# Altium schematic sheet FG Command Controller Electronic Scheme_2021-10-20.schdoc
size 297 x 203 mm
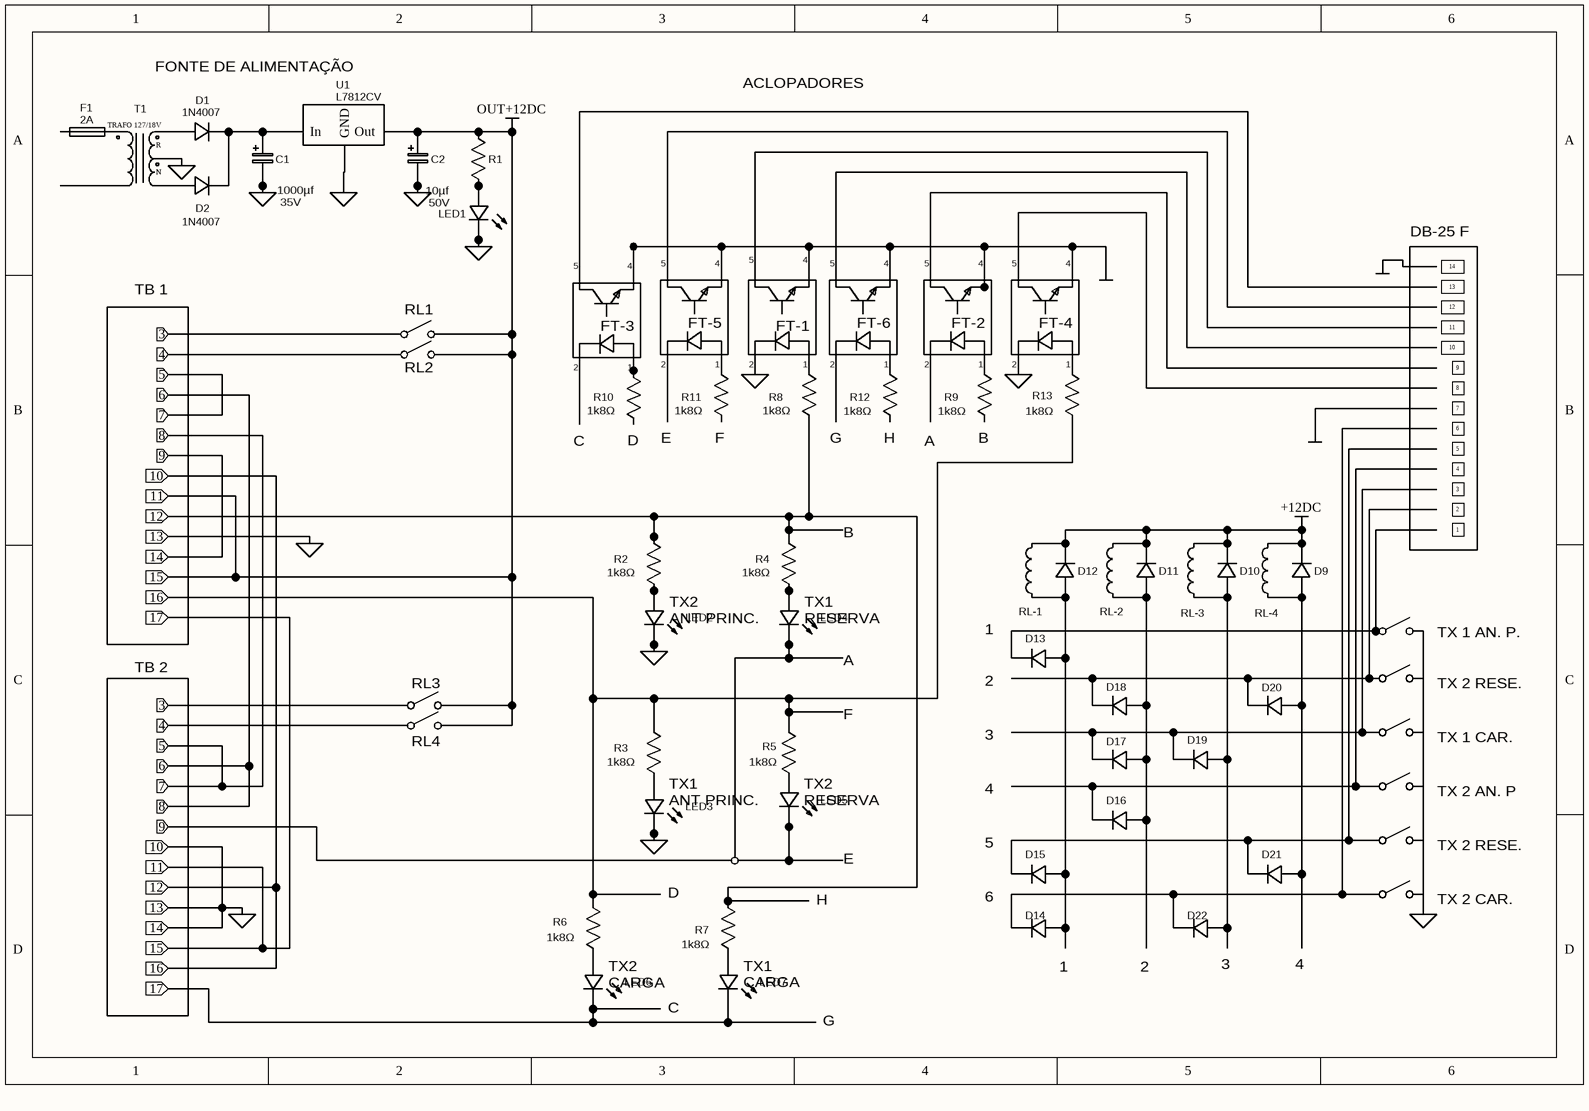
[diagram p0: FG Command Controller Electronic Scheme_2021-10-20.schdoc]

## Parts
6  MMBT5551  [SOT-23(SOT-23-3)]  (value not drawn)
C1  1u  [CAP-D3.0XF1.5]  (value not drawn)
C2  1u  [CAP-D3.0XF1.5]  (value not drawn)
D1  1N4007  [DO35-10]
D2  1N4007  [DO35-10]
D3  1N4148  [DO35-10]  (value not drawn)
D4  1N4148  [DO35-10]  (value not drawn)
D5  1N4148  [DO35-10]  (value not drawn)
D6  1N4148  [DO35-10]  (value not drawn)
D7  1N4148  [DO35-10]  (value not drawn)
D8  1N4148  [DO35-10]  (value not drawn)
D9  1N4148  [DO35-10]  (value not drawn)
D10  1N4148  [DO35-10]  (value not drawn)
D11  1N4148  [DO35-10]  (value not drawn)
D12  1N4148  [DO35-10]  (value not drawn)
D13  1N4148  [DO35-10]  (value not drawn)
D14  1N4148  [DO35-10]  (value not drawn)
D15  1N4148  [DO35-10]  (value not drawn)
D16  1N4148  [DO35-10]  (value not drawn)
D17  1N4148  [DO35-10]  (value not drawn)
D18  1N4148  [DO35-10]  (value not drawn)
D19  1N4148  [DO35-10]  (value not drawn)
D20  1N4148  [DO35-10]  (value not drawn)
D21  1N4148  [DO35-10]  (value not drawn)
D22  1N4148  [DO35-10]  (value not drawn)
F1  2A  [2A-3F-250VAC]
LED1  LED 3MM  [LED-3MM/2.54]  (value not drawn)
LED2  NO  [LED-3MM/2.54]  (value not drawn)
LED3  LED 3MM  [LED-3MM/2.54]  (value not drawn)
LED4  LED 3MM  [LED-3MM/2.54]  (value not drawn)
LED5  LED 3MM  [LED-3MM/2.54]  (value not drawn)
LED6  LED 3MM  [LED-3MM/2.54]  (value not drawn)
LED7  LED 3MM  [LED-3MM/2.54]  (value not drawn)
Q1  MMBT5551  [SOT-23(SOT-23-3)]  (value not drawn)
Q3  MMBT5551  [SOT-23(SOT-23-3)]  (value not drawn)
Q4  MMBT5551  [SOT-23(SOT-23-3)]  (value not drawn)
Q5  MMBT5551  [SOT-23(SOT-23-3)]  (value not drawn)
Q6  MMBT5551  [SOT-23(SOT-23-3)]  (value not drawn)
R1  1k  [AXIAL-0.3]  (value not drawn)
R2  1k  [AXIAL-0.3]  (value not drawn)
R3  1k  [AXIAL-0.3]  (value not drawn)
R4  1k  [AXIAL-0.3]  (value not drawn)
R5  1k  [AXIAL-0.3]  (value not drawn)
R6  1k  [AXIAL-0.3]  (value not drawn)
R7  1k  [AXIAL-0.3]  (value not drawn)
R8  1k  [AXIAL-0.3]  (value not drawn)
R9  1k  [AXIAL-0.3]  (value not drawn)
R10  1k  [AXIAL-0.3]  (value not drawn)
R11  1k  [AXIAL-0.3]  (value not drawn)
R12  1k  [AXIAL-0.3]  (value not drawn)
R13  1k  [AXIAL-0.3]  (value not drawn)
RL-1  1m  [AXIAL-0.4]  (value not drawn)
RL-2  1m  [AXIAL-0.4]  (value not drawn)
RL-3  1m  [AXIAL-0.4]  (value not drawn)
RL-4  1m  [AXIAL-0.4]  (value not drawn)
T1  XFMR_TAP  [TRANSFORMER 2 TO 3]  (value not drawn)
U1  L7812CV  [SOT-223]

## Blocks framed on the sheet
FT-3: D6 Q3
FT-5: D4 Q5
FT-1: D8 Q1
FT-6: D3 Q6
FT-2: 6 D7
FT-4: D5 Q4

## Ports
1 (in), 2 (in), 3 (in), 4 (in), 5 (in), 6 (in), 7 (in), 8 (in), 9 (in), 10 (in), 11 (in), 12 (in), 13 (in), 14 (in), 15 (in), 16 (in), 17 (in)

## Nets
+12DC: D9.2(-) D10.2(-) D11.2(-) D12.2(-) RL-1.2 RL-2.2 RL-3.2 RL-4.2
GND: 6.3(E) C1.2 C2.2 D5.2(-) D8.2(-) LED1.2(-) LED2.2(-) LED3.2(-) LED4.2(-) LED5.2(-) Q1.3(E) Q3.3(E) Q4.3(E) Q5.3(E) Q6.3(E) R2.2 R3.2 R4.2 R5.2 R6.2 R7.2 R8.1 R13.1 T1.4 U1.1(GND) ; port 9, port 10, port 12, port 13, port 14, port 16
OUT+12DC: C2.1 LED6.2(-) LED7.2(-) R1.2 U1.2(Out) ; port 11, port 15, port 17
5: port 5, port 6, port 7, port 8
NetC1_1: C1.1 D1.2(-) D2.2(-) U1.3(In)
NetD1_1: D1.1(+) T1.5
NetD2_1: D2.1(+) T1.3
NetD3_1: D3.1(+) R12.2
NetD4_1: D4.1(+) R11.2
NetD5_1: D5.1(+) R13.2
NetD6_1: D6.1(+) R10.2
NetD7_1: D7.1(+) R9.2
NetD8_1: D8.1(+) R8.2
NetD9_1: D9.1(+) D12.1(+) D13.1(+) D13.2(-) D14.1(+) D15.1(+) D20.1(+) D21.1(+) RL-1.1 RL-4.1
NetD10_1: D10.1(+) D19.1(+) D22.1(+) RL-3.1
NetD11_1: D11.1(+) D16.1(+) D17.1(+) D18.1(+) RL-2.1
NetD14_2: D14.2(-) D22.2(-)
NetD15_2: D15.2(-) D21.2(-)
NetD17_2: D17.2(-) D18.2(-) D19.2(-) D20.2(-)
NetF1_2: F1.2 T1.1
NetLED1_1: LED1.1(+) R1.1
NetLED2_1: LED2.1(+) R2.1
NetLED3_1: LED3.1(+) R3.1
NetLED4_1: LED4.1(+) R4.1
NetLED5_1: LED5.1(+) R5.1
NetLED6_1: LED6.1(+) R6.1
NetLED7_1: LED7.1(+) R7.1

Not connected (* = marked no-connect by the designer): 6 1(B) 2(C); D3 2(-); D4 2(-); D6 2(-); D7 2(-); D16 2(-); F1 1; Q1 1(B) 2(C); Q3 1(B) 2(C); Q4 1(B) 2(C); Q5 1(B) 2(C); Q6 1(B) 2(C); R9 1; R10 1; R11 1; R12 1; T1 2

## Notes on the sheet
- FONTE DE ALIMENTAÇÃO
- ACLOPADORES
- 1000µf
  35V
- 10µf
  50V
- TB 1
- (near Q3) 5
- (near Q3) 4
- (near Q5) 5
- (near Q5) 4
- (near Q1) 5
- (near Q1) 4
- 5
- (near Q6) 4
- (near 6) 5
- (near 6) 4
- (near Q4) 5
- (near Q4) 4
- DB-25 F
- RL1
- (near D6) 2
- (near R10) 1
- 2
- (near R11) 1
- (near R8) 1
- (near R12) 1
- (near R9) 1
- (near R13) 1
- RL2
- (near R10) 1k8Ω
- 1k8Ω
- (near R9) 1k8Ω
- C
- (near R10) D
- (near R10) E
- (near R11) F
- (near R8) G
- (near R12) H
- A
- (near R9) B
- B
- (near LED4) TX2
  ANT PRINC.
- TX1
  RESERVA
- 1
- TX 1 AN. P.
- TB 2
- RL3
- (near D13) 2
- TX 2 RESE.
- RL4
- TX1
  ANT PRINC.
- TX2
  RESERVA
- F
- 3
- TX 1 CAR.
- 4
- TX 2 AN. P
- D
- H
- E
- (near D15) 5
- 6
- TX 2 CAR.
- (near LED7) TX2
  CARGA
- TX1
  CARGA
- (near D14) 1
- (near D22) 3
- G
- (in symbol XFMR_TAP) TRAFO 127/18V; R; N

## Library data of the parts
6 Q1 Q3-Q6 = MMBT5551: BOM_Manufacturer: CJ; BOM_Supplier: LCSC; BOM_Manufacturer Part: MMBT5551; image: http://image.lceda.cn/szlcsc/C28088.jpg; spicePre: Q; BOM_Supplier Part: C28088
C1 C2 = 1u: nameAlias: Value(F); BOM_Manufacturer Part: ?; spicePre: C; spiceSymbolName: Capacitor
F1 = 2A: BOM_Manufacturer Part: Glass tube fuse2A 3F 250VAC; BOM_Manufacturer: XCFuse; BOM_Supplier: LCSC; image: http://image.lceda.cn/szlcsc/C71017.jpg; spicePre: F; BOM_Supplier Part: C71017
LED1 LED3-LED7 = LED 3MM: BOM_Manufacturer: EVERLIGHT; BOM_Manufacturer Part: 204-10UYC/S530-A3; BOM_Supplier: LCSC; spicePre: L
LED2 = NO: BOM_Manufacturer: EVERLIGHT; BOM_Manufacturer Part: 204-10UYC/S530-A3; BOM_Supplier: LCSC; spicePre: L
R1-R13 = 1k: nameAlias: Value(Ω); BOM_Manufacturer Part: ?; spicePre: R; spiceSymbolName: Res_AXIAL-0.3(1/8W)_US
RL-1-RL-4 = 1m: nameAlias: Value(H); BOM_Manufacturer Part: ?; spicePre: L; spiceSymbolName: Inductor
T1 = XFMR_TAP: RATIO: 2; spicePre: X; BOM_Manufacturer Part: ?
U1 = L7812CV: BOM_Manufacturer: AMS; BOM_Manufacturer Part: AMS1117-3.3; sourceId: dwIGgezVh; timeStamp: 1476261164; BOM_Supplier: LCSC; BOM_LCSC Assembly: Yes; image: http://image.lceda.cn/szlcsc/C6186.jpg; spicePre: U; BOM_Supplier Part: C6186
D1 D2 = 1N4007: BOM_Manufacturer Part: ?; spicePre: D
D3-D22 = 1N4148: BOM_Manufacturer Part: ?; spicePre: D